# Altium project MLAB_Hazi.PrjPcb
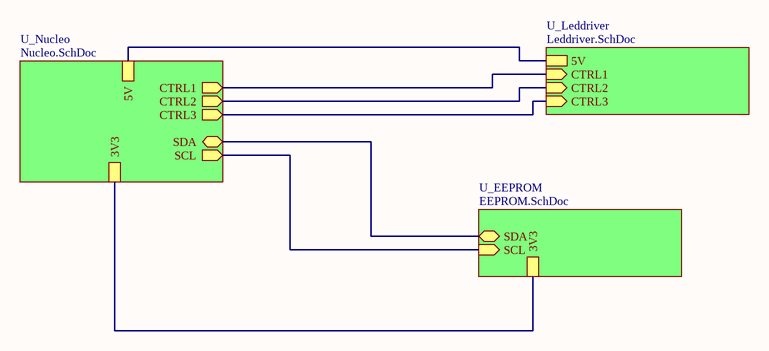
[diagram p0: MainSheet.SchDoc]
3 sheets, 23 parts. Net scope: hierarchical (ports join the sheet entries above them; power ports are global).
Board file: hazi_kiindulas.PcbDoc
Sheets:
  MainSheet.SchDoc
    U_Leddriver = Leddriver.SchDoc
    U_Nucleo = Nucleo.SchDoc

## Sheet MainSheet.SchDoc: Kapcsolás a schematikok között
size A4; ENG_APP_DATE: --/--/--; DSN_APP_DATE: --/--/--; CHK_APP_DATE: --/--/--; Author: Horváth Patrik; Organization: BME-AUT; DocumentNumber: 1; Revision: A29; SheetNumber: 1; SheetTotal: 4

### Sub-sheets
U_EEPROM = EEPROM.SchDoc (file not in this document): 3V3, SDA (bidir), SCL (in)
U_Leddriver = Leddriver.SchDoc: 5V, CTRL1 (in), CTRL2 (in), CTRL3 (in)
U_Nucleo = Nucleo.SchDoc: SDA (bidir), SCL (out), 3V3, 5V, CTRL1 (out), CTRL2 (out), CTRL3 (out)

### Nets
3V3: sheet U_Nucleo/3V3, sheet U_EEPROM/3V3
+5V: sheet U_Leddriver/5V, sheet U_Nucleo/5V
NetU1_42: sheet U_Nucleo/SCL, sheet U_EEPROM/SCL
NetU1_57: sheet U_Nucleo/SDA, sheet U_EEPROM/SDA
NetU1_59: sheet U_Leddriver/CTRL2, sheet U_Nucleo/CTRL2
NetU1_61: sheet U_Leddriver/CTRL1, sheet U_Nucleo/CTRL1
NetU1_71: sheet U_Leddriver/CTRL3, sheet U_Nucleo/CTRL3

### Notes on the sheet
- Title
- Size:
- Date:
- A4
- Number:
- Time:
- Revision:
- Sheet
- of
- File:

## Sheet Leddriver.SchDoc: LED meghajtó áramkör
size A4; ENG_APP_DATE: --/--/--; DSN_APP_DATE: --/--/--; CHK_APP_DATE: --/--/--; Author: Horváth Patrik; Organization: BME-AUT; DocumentNumber: 3; Revision: A29; SheetNumber: 3; SheetTotal: 4
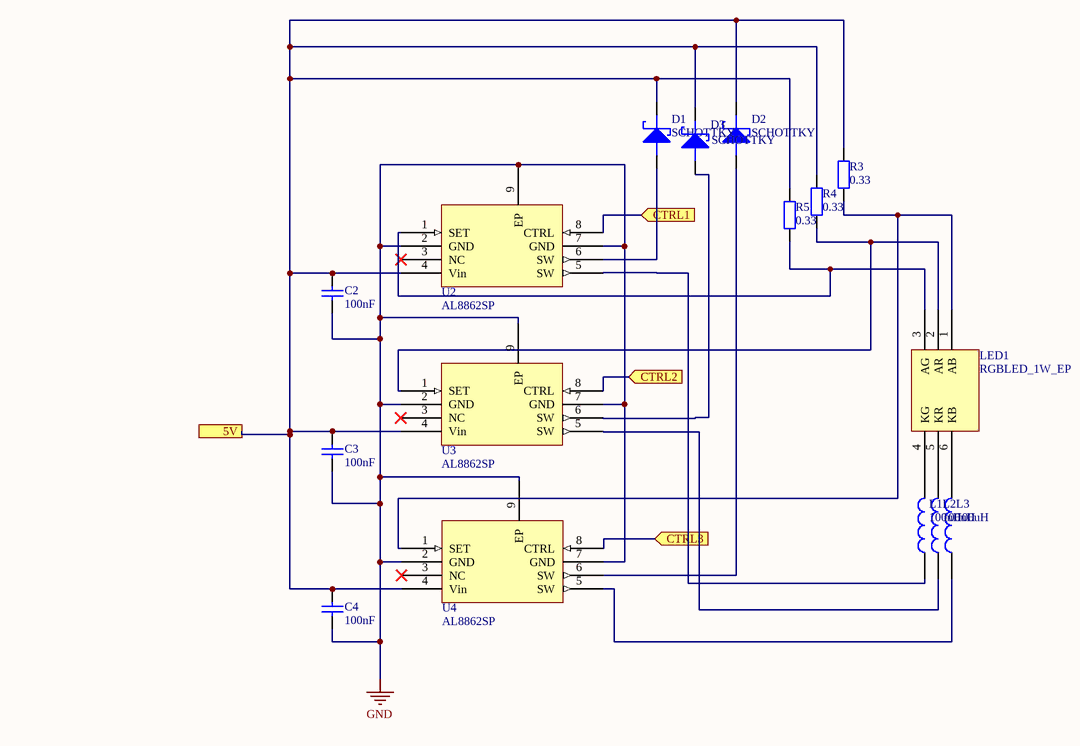
[diagram p1: Leddriver.SchDoc]

### Parts
C2  100nF  [FP_0805_CAP_085]
C3  100nF  [FP_0805_CAP_085]
C4  100nF  [FP_0805_CAP_085]
D1  SCHOTTKY  [FP_SOD-123]
D2  SCHOTTKY  [FP_SOD-123]
D3  SCHOTTKY  [FP_SOD-123]
L1  100uH  [INDP5350X45N]
L2  100uH  [INDP5350X45N]
L3  100uH  [INDP5350X45N]
LED1  RGBLED_1W_EP  [RGBLED_1W_EP]
R3  value 0.33  [FP_0805_RES]  (hidden comment: 0.22)
R4  value 0.33  [FP_0805_RES]  (hidden comment: 0.22)
R5  value 0.33  [FP_0805_RES]  (hidden comment: 0.22)
U2  AL8862SP  [SOIC127P600-8N_LEd_Driver]
U3  AL8862SP  [SOIC127P600-8N_LEd_Driver]
U4  AL8862SP  [SOIC127P600-8N_LEd_Driver]

### Ports
5V, CTRL1 (in), CTRL2 (in), CTRL3 (in)

### Nets
GND: C2.1 C3.1 C4.1 U2.2(GND) U2.7(GND) U2.9(EP) U3.2(GND) U3.7(GND) U3.9(EP) U4.2(GND) U4.7(GND) U4.9(EP)
+5V: C2.2 C3.2 C4.2 D1.2(CATHODE) D2.2(CATHODE) D3.2(CATHODE) R3.2 R4.2 R5.2 U2.4(Vin) U3.4(Vin) U4.4(Vin) ; port 5V
NetD1_1: D1.1(ANODE) U2.6(SW)
NetD2_1: D2.1(ANODE) U4.6(SW)
NetD3_1: D3.1(ANODE) U3.6(SW)
NetL1_1: L1.1 U2.5(SW)
NetL1_2: L1.2 LED1.4(KG)
NetL2_1: L2.1 U3.5(SW)
NetL2_2: L2.2 LED1.5(KR)
NetL3_1: L3.1 U4.5(SW)
NetL3_2: L3.2 LED1.6(KB)
NetLED1_1: LED1.1(AB) R3.1 U4.1(SET)
NetLED1_2: LED1.2(AR) R4.1 U3.1(SET)
NetLED1_3: LED1.3(AG) R5.1 U2.1(SET)
NetU1_59: U3.8(CTRL) ; port CTRL2
NetU1_61: U2.8(CTRL) ; port CTRL1
NetU1_71: U4.8(CTRL) ; port CTRL3

Not connected (* = marked no-connect by the designer): U2 3(NC)*; U3 3(NC)*; U4 3(NC)*

### Notes on the sheet
- Title
- Size:
- Date:
- A4
- Number:
- Time:
- Revision:
- Sheet
- of
- File:

### Library data of the parts
C2-C4 = CAP: Capacitor; Name: 100nF 0805 10% 50V X7R 0805B104K500NT; Supplier: Lomex; Reference: 82-13-46; Value: 100nF
D1-D3 = SCHOTTKY: Schottky diode; Name: 1A 40V SCH.RECT.LOW Vf S14; Supplier: Lomex; Reference: 83-03-00
L1-L3 = IND: Inductor; Reference: 3288245; Name: VLS5045EX-101M-H; Supplier: Farnell; Value: 100uH
LED1 = RGBLED_1W_EP: Name: FYLP-1W-RGBB; Reference: 95-03-19; Supplier: Lomex
R3-R5 = RES: Resistor; Name: ERJS6QFR33V 0.33ohm prec ellenállás; Reference: 2381080; Supplier: Farnell
U2-U4 = AL8862SP: Reference: 3518291; Name: AL8862SP; Supplier: Farnell

## Sheet Nucleo.SchDoc: MCU áramkör+ táp
size A4; ENG_APP_DATE: --/--/--; DSN_APP_DATE: --/--/--; CHK_APP_DATE: --/--/--; Author: Horváth Patrik; Organization: BME-AUT; DocumentNumber: 2; Revision: A29; SheetNumber: 2; SheetTotal: 4
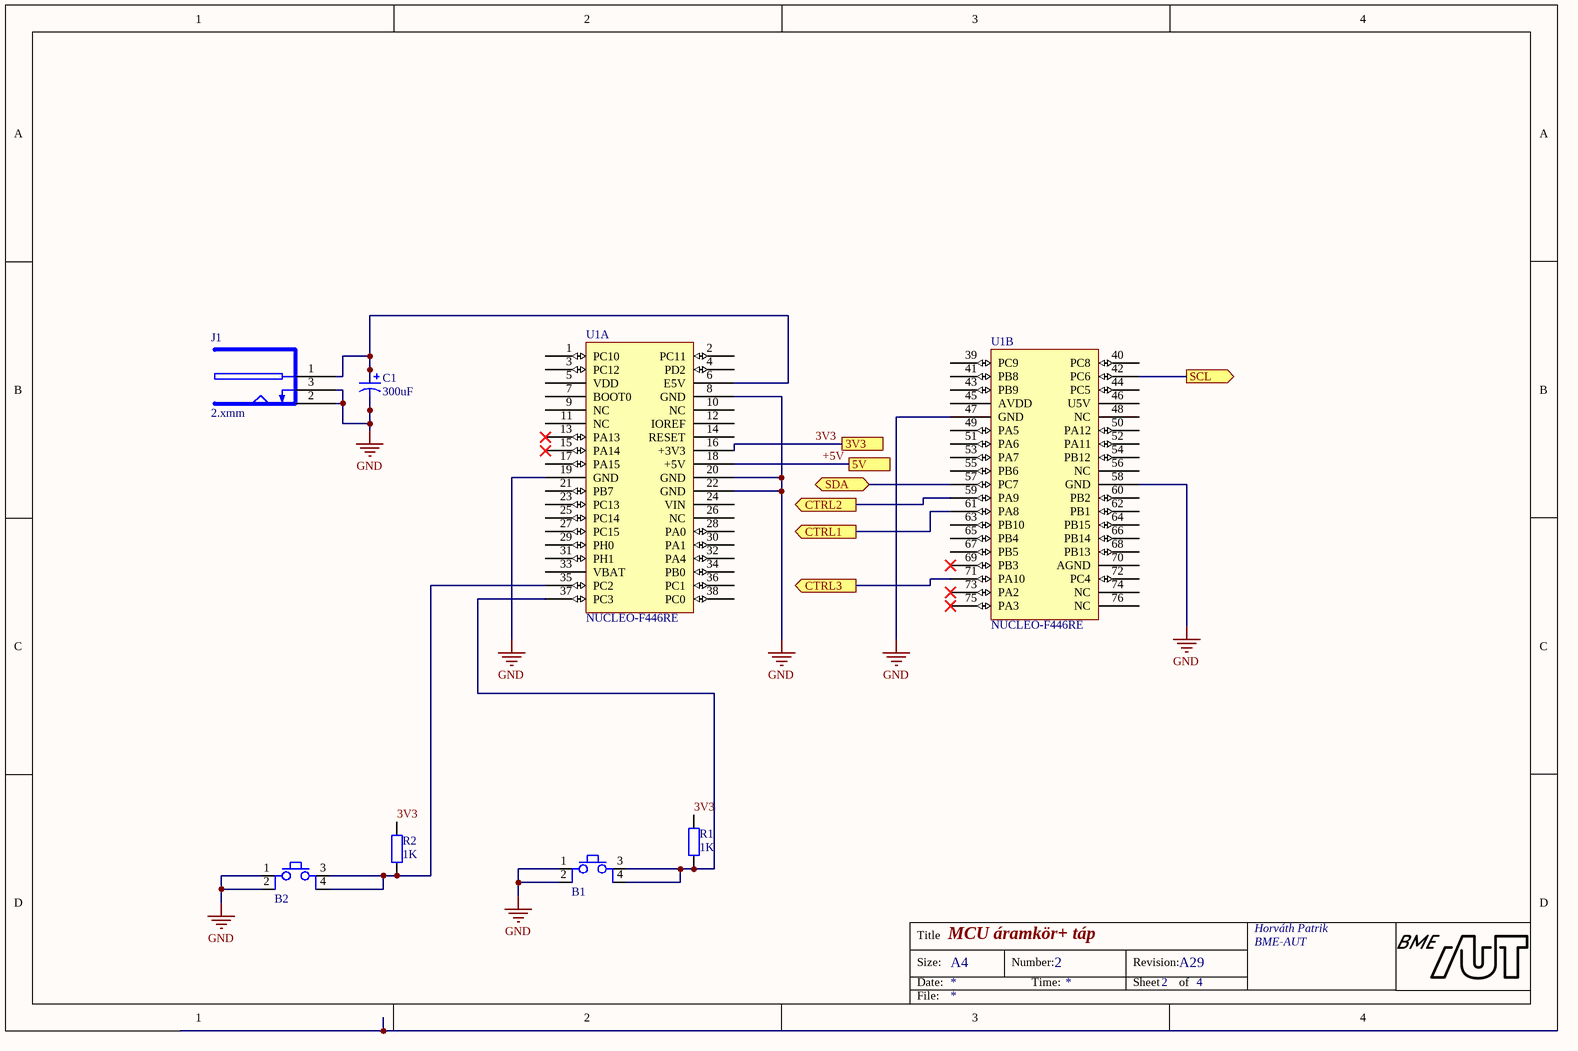
[diagram p2: Nucleo.SchDoc]

### Parts
B1  Button  [FP_BTN_SMD]  (value not drawn)
B2  Button  [FP_BTN_SMD]  (value not drawn)
C1  value 300uF  [CAP_AE_8x10]  (hidden comment: 100nF)
J1  2.xmm  [FP_DC_TAP_ANYA]
R1  1K  [FP_0805_RES]
R2  1K  [FP_0805_RES]
U1  NUCLEO-F446RE  [FP_NUCLEO-64]  (parts A,B of 2)

### Ports
3V3, 5V, CTRL1 (out), CTRL2 (out), CTRL3 (out), SCL (out), SDA (bidir)

### Nets
GND: B1.1 B1.2 B2.1 B2.2 C1.1 J1.2(SLEEVE) J1.3(BREAK) U1.8(GND) U1.19(GND) U1.20(GND) U1.22(GND) U1.47(GND) U1.58(GND)
3V3: R1.2 R2.2 U1.16(+3V3) ; port 3V3
+5V: U1.18(+5V) ; port 5V
NetB1_3: B1.3 B1.4 R1.1 U1.37(PC3)
NetB2_3: B2.3 B2.4 R2.1 U1.35(PC2)
NetC1_2: C1.2 J1.1(PIN) U1.6(E5V)
NetU1_42: U1.42(PC6) ; port SCL
NetU1_57: U1.57(PC7) ; port SDA
NetU1_59: U1.59(PA9) ; port CTRL2
NetU1_61: U1.61(PA8) ; port CTRL1
NetU1_71: U1.71(PA10) ; port CTRL3

Not connected (* = marked no-connect by the designer): U1 1(PC10) 2(PC11) 3(PC12) 4(PD2) 5(VDD) 7(BOOT0) 9(NC) 10(NC) 11(NC) 12(IOREF) 13(PA13)* 14(RESET) 15(PA14)* 17(PA15) 21(PB7) 23(PC13) 24(VIN) 25(PC14) 26(NC) 27(PC15) 28(PA0) 29(PH0) 30(PA1) 31(PH1) 32(PA4) 33(VBAT) 34(PB0) 36(PC1) 38(PC0) 39(PC9) 40(PC8) 41(PB8) 43(PB9) 44(PC5) 45(AVDD) 46(U5V) 48(NC) 49(PA5) 50(PA12) 51(PA6) 52(PA11) 53(PA7) 54(PB12) 55(PB6) 56(NC) 60(PB2) 62(PB1) 63(PB10) 64(PB15) 65(PB4) 66(PB14) 67(PB5) 68(PB13) 69(PB3)* 70(AGND) 72(PC4) 73(PA2)* 74(NC) 75(PA3)* 76(NC)

### Notes on the sheet
- Title
- Size:
- Date:
- A4
- Number:
- Time:
- Revision:
- Sheet
- of
- File:

### Library data of the parts
B1 B2 = Button 4P: Push button; Name: FSM4JSMA; Reference: 45-05-43; Supplier: Lomex
C1 = CAP_ELECT: Polarized Capacitor; Name: 330uF 25V 8x10mm 20% 105° 8331LDM0810MZ0001T (FNG) LOW IMP.; Supplier: Lomex; Reference: 91-01-29
J1 = DC_TAP_ANYA: 2.xmm DC HEBA25 TÁPFESZÜLTSÉG ALJZAT ZÁRT, NYÁKBA 90°; Name: TÁP DC ANYA 5.5/2.1/9.5mm DCS-5521-5; Supplier: Lomex; Reference: 43-07-67
R1 R2 = RES: Resistor; Name: 1K00 0805 5% WR08X102JTL 0.125W (WAL); Supplier: Lomex; Reference: 81-27-93; Value: 1K
U1 = NUCLEO-F446RE: Reference: NUCLEO; Name: Nucleo F446RE; Supplier: Tanszék

## Nets that join several sheets
GND: Leddriver (12 pins), Nucleo (13 pins)
+5V: Leddriver (12 pins), Nucleo (U1.18)
NetU1_59: Leddriver (U3.8), Nucleo (U1.59)
NetU1_61: Leddriver (U2.8), Nucleo (U1.61)
NetU1_71: Leddriver (U4.8), Nucleo (U1.71)